# EAGLE design Tomo5 (EAGLE 7.6.0)
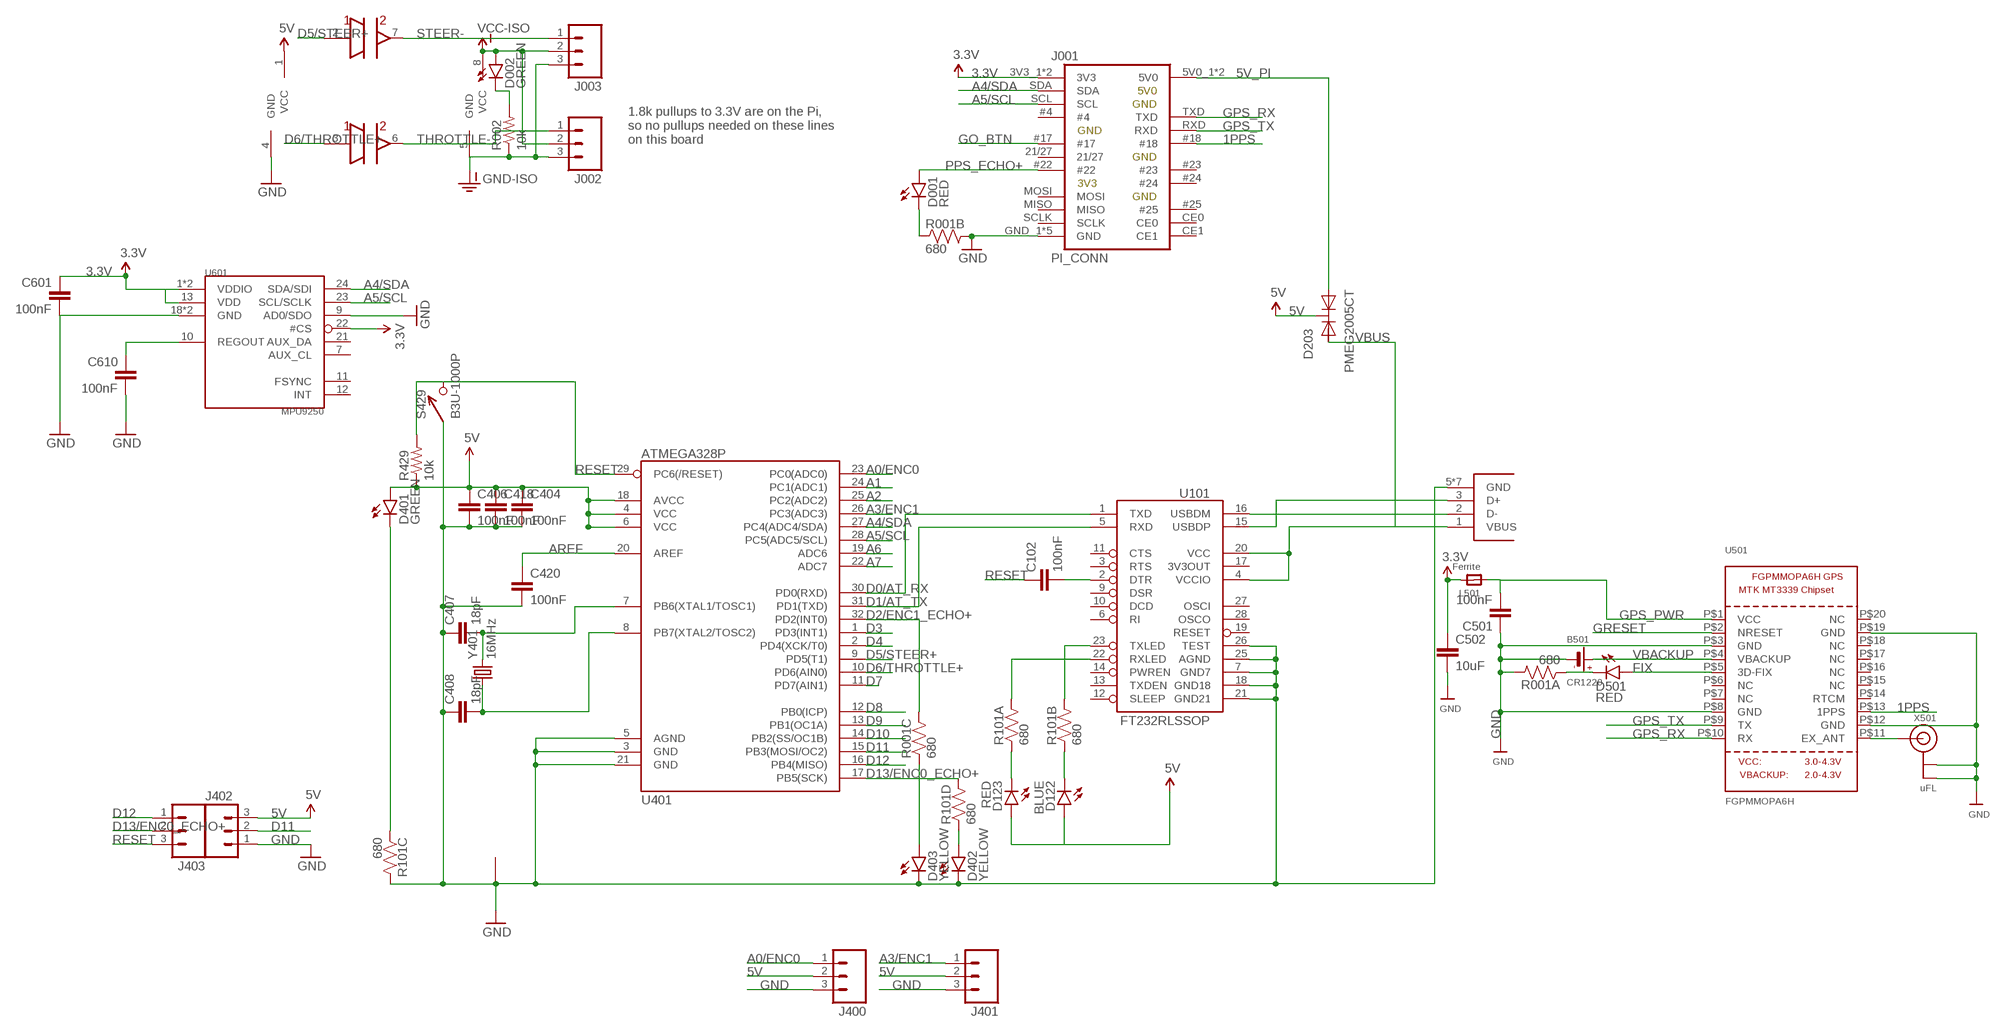
[diagram p0: schematic, sheet 1]

## Parts
B501  CR1220  BATTERYCR1220_2  [CR1220-2]
C102  100nF  CAP0402-CAP  [0402-CAP]
C404  100nF  CAP0402-CAP  [0402-CAP]
C406  100nF  CAP0402-CAP  [0402-CAP]
C407  18pF  CAP0402-CAP  [0402-CAP]
C408  18pF  CAP0402-CAP  [0402-CAP]
C418  100nF  CAP0402-CAP  [0402-CAP]
C420  100nF  CAP0402-CAP  [0402-CAP]
C501  100nF  CAP0402-CAP  [0402-CAP]
C502  10uF  CAP1206  [1206]
C601  100nF  0.1UF-25V(+80/-20%)(0603)  [0603-CAP]
C610  100nF  CAP0402-CAP  [0402-CAP]
D001  RED  LED0603  [LED-0603]
D002  GREEN  LED0603  [LED-0603]
D122  BLUE  LED0603  [LED-0603]
D123  RED  LED0603  [LED-0603]
D203  PMEG2005CT  DIODE_COMMON_CATHODEPMEG2005CT  [SOT-23-3]
D401  GREEN  LED0603  [LED-0603]
D402  YELLOW  LED0603  [LED-0603]
D403  YELLOW  LED0603  [LED-0603]
D501  RED  LED0603  [LED-0603]
J001  PI_CONN  [PI_CONN]
J002  M03PTH  [1X03]
J003  M03PTH  [1X03]
J101  USB_MICROB_JST  [UB-MC5BR3-SD204-4S]
J400  M03PTH  [1X03]
J401  M03PTH  [1X03]
J402  M03PTH  [1X03]
J403  M03PTH  [1X03]
L501  Ferrite  FERRITE-0805NO  [0805-NO]
R001  680  RP404  [CRA04]
R002  10k  RESISTOR0402-RES  [0402-RES]
R101  680  RP404  [CRA04]
R429  10k  RESISTOR0402-RES  [0402-RES]
S429  B3U-1000P  [B3U-1000P]
U101  FT232RLSSOP  [SSOP28DB]
U401  ATMEGA328P  ATMEGA168  [TQFP32-08]
U501  FGPMMOPA6H  GPS_FGPMMOPA6H  [FGPMMOPA6H]
U601  MPU9250  [LQFN_3MM_3MM]
U$7  ADUM3221  [SO8N]
X501  uFL  ANTENNA_U.FL  [U.FL]
Y401  16MHz  CX2520  [CRYSTAL_SMD_2MM_2_5MM]

## Nets
1PPS: J001.#18 U501.P$13(1PPS)
3.3V: C502.1 C601.1 J001.3V3_1(3V3) J001.3V3_2(3V3) L501.2 U601.1(VDDIO) U601.8(VDDIO) U601.13(VDD) U601.22(#CS)
5V: C404.1 C406.1 C418.1 D122.A D123.A D203.3(K) D401.A J400.2 J401.2 J402.3 R429.1 U401.4(VCC) U401.6(VCC) U401.18(AVCC) U$7.1(INP:VCC)
5V_PI: D203.1(A1) J001.5V0_1(5V0) J001.5V0_2(5V0)
A0/ENC0: J400.1 U401.23(PC0(ADC0))
A1: U401.24(PC1(ADC1))
A2: U401.25(PC2(ADC2))
A3/ENC1: J401.1 U401.26(PC3(ADC3))
A4/SDA: J001.SDA U401.27(PC4(ADC4/SDA)) U601.24(SDA/SDI)
A5/SCL: J001.SCL U401.28(PC5(ADC5/SCL)) U601.23(SCL/SCLK)
A6: U401.19(ADC6)
A7: U401.22(ADC7)
AREF: C420.1 U401.20(AREF)
D0/AT_RX: U101.1(TXD) U401.30(PD0(RXD))
D1/AT_TX: U101.5(RXD) U401.31(PD1(TXD))
D2/ENC1_ECHO+: R001.6 U401.32(PD2(INT0))
D3: U401.1(PD3(INT1))
D4: U401.2(PD4(XCK/T0))
D5/STEER+: U401.9(PD5(T1)) U$7.2(A:IN)
D6/THROTTLE+: U401.10(PD6(AIN0)) U$7.3(B:IN)
D7: U401.11(PD7(AIN1))
D8: U401.12(PB0(ICP))
D9: U401.13(PB1(OC1A))
D10: U401.14(PB2(SS/OC1B))
D11: J402.2 U401.15(PB3(MOSI/OC2))
D12: J403.1 U401.16(PB4(MISO))
D13/ENC0_ECHO+: J403.2 R101.5 U401.17(PB5(SCK))
DTR#: C102.2 U101.2(DTR)
ENC0_ECHO-: D402.A R101.4
FIX: D501.A U501.P$5(3D-FIX)
GND: B501.- C404.2 C406.2 C407.1 C408.1 C418.2 C420.2 C501.1 C502.2 C601.2 C610.2 D402.C D403.C J001.GND_1(GND) J001.GND_2(GND) J001.GND_3(GND) J001.GND_4(GND) J001.GND_5(GND) J101.5(GND) J101.P$6(GND) J101.P$7(GND) J101.P$8(GND) J101.P$9(GND) J101.P$10(GND) J101.P$11(GND) J400.3 J401.3 J402.1 R001.7 R001.8 R101.6 S429.P$1 U101.7(GND7) U101.18(GND18) U101.21(GND21) U101.25(AGND) U101.26(TEST) U401.3(GND) U401.5(AGND) U401.21(GND) U501.P$3(GND) U501.P$8(GND) U501.P$12(GND) U501.P$19(GND) U601.9(AD0/SDO) U601.18(GND) U601.20(GND) U$7.4(INP:GND) X501.1(GND) X501.2(GND) Y401.2 Y401.4
GND-ISO: J002.3 J003.3 R002.1 U$7.5(OUTP:GND)
GO_BTN: J001.#17
GPS_PWR: C501.2 L501.1 U501.P$1(VCC)
GPS_RX: J001.TXD U501.P$10(RX)
GPS_TX: J001.RXD U501.P$9(TX)
GRESET: U501.P$2(NRESET)
IPWR-: D002.C R002.2
N$1: C407.2 U401.7(PB6(XTAL1/TOSC1)) Y401.3
N$2: C408.2 U401.8(PB7(XTAL2/TOSC2)) Y401.1
N$3: J101.3(D+) U101.15(USBDP)
N$4: J101.2(D-) U101.16(USBDM)
N$5: D401.C R101.3
N$6: D501.C R001.1
N$7: U501.P$11(EX_ANT) X501.3(SIGNAL)
N$8: D403.A R001.3
PPS_ECHO+: D001.A J001.#22
PPS_ECHO-: D001.C R001.2
REGOUT: C610.1 U601.10(REGOUT)
RESET: C102.1 J403.3 R429.2 S429.P$2 U401.29(PC6(/RESET))
RXLED+: D123.C R101.1
RXLED-: R101.8 U101.22(RXLED)
STEER-: J003.1 U$7.7(A:OUT)
THROTTLE-: J002.1 U$7.6(B:OUT)
TXLED+: D122.C R101.2
TXLED-: R101.7 U101.23(TXLED)
VBACKUP: B501.+ U501.P$4(VBACKUP)
VBUS: D203.2(A2) J101.1(VBUS) U101.4(VCCIO) U101.20(VCC)
VCC-ISO: D002.A J002.2 J003.2 U$7.8(OUTP:VCC)
Unconnected: J001.21/27 J001.#4 J001.#23 J001.#24 J001.#25 J001.CE0 J001.CE1 J001.MISO J001.MOSI J001.SCLK R001.4 R001.5 U101.3(RTS) U101.6(RI) U101.9(DSR) U101.10(DCD) U101.11(CTS) U101.12(SLEEP) U101.13(TXDEN) U101.14(PWREN) U101.17(3V3OUT) U101.19(RESET) U101.27(OSCI) U101.28(OSCO) U501.P$6(NC) U501.P$7(NC) U501.P$14(RTCM) U501.P$15(NC) U501.P$16(NC) U501.P$17(NC) U501.P$18(NC) U501.P$20(NC) U601.7(AUX_CL) U601.11(FSYNC) U601.12(INT) U601.21(AUX_DA)

## Notes on the sheet
- 1.8k pullups to 3.3V are on the Pi, 
  so no pullups needed on these lines
  on this board

## Library data of the parts
B501 = microbuilder:BATTERY: CR1220 SMT - Digikey: 3001K-ND CD2032 BAT-HLD-001 - Digikey: BAT-HLD-001-ND
C102 C404 C406 C418 C420 C501 = SparkFun:CAP: Capacitor Standard 0603 ceramic capacitor, and 0.1" leaded capacitor.; DIGIKEY: 445-1268-1-ND
C407 C408 = SparkFun:CAP: Capacitor Standard 0603 ceramic capacitor, and 0.1" leaded capacitor.; DIGIKEY: 445-1238-1-ND
C502 C610 = SparkFun-Capacitors:CAP: Capacitor Standard 0603 ceramic capacitor, and 0.1" leaded capacitor.
C601 = SparkFun-Capacitors:0.1UF-25V(+80/-20%)(0603): CAP-00810 Ceramic Standard decoupling cap; PROD_ID: CAP-00810; VALUE: 0.1uF
D001 D501 = SparkFun-LED:LED: LEDs Standard schematic elements and footprints for 5mm, 3mm, 1206, and 0603 sized LEDs. 5mm - Spark Fun Electronics SKU : COM-00529 (and others)
D002 D401 = SparkFun-LED:LED: LEDs Standard schematic elements and footprints for 5mm, 3mm, 1206, and 0603 sized LEDs. 5mm - Spark Fun Electronics SKU : COM-00529 (and others); DIGIKEY: 350-2036-1-ND
D122 = SparkFun-LED:LED: LEDs Standard schematic elements and footprints for 5mm, 3mm, 1206, and 0603 sized LEDs. 5mm - Spark Fun Electronics SKU : COM-00529 (and others); DIGIKEY: 350-2037-1-ND
D123 = SparkFun-LED:LED: LEDs Standard schematic elements and footprints for 5mm, 3mm, 1206, and 0603 sized LEDs. 5mm - Spark Fun Electronics SKU : COM-00529 (and others); DIGIKEY: 754-1359-1-ND
D203 = KwanSystems:DIODE_COMMON_CATHODE
D402 D403 = SparkFun-LED:LED: LEDs Standard schematic elements and footprints for 5mm, 3mm, 1206, and 0603 sized LEDs. 5mm - Spark Fun Electronics SKU : COM-00529 (and others); DIGIKEY: 754-1124-1-ND
J001 = KwanSystems:PI_CONN: Raspberry Pi A/B 26-pin connector. Not valid for Pi 2/3, which have 40 pin connectors.
J002 J003 J400-J403 = SparkFun-Connectors:M03: Header 3 Standard 3-pin 0.1" header. Use with straight break away headers (SKU : PRT-00116), right angle break away headers (PRT-00553), swiss pins (PRT-00743), machine pins (PRT-00117), and female headers (PRT-00115). Molex polarized connector foot print use with SKU : PRT-08232 with associated crimp pins and housings.; DIGIKEY: $NOPART
J101 = KwanSystems:USB_MICROB_JST; DIGIKEY: 455-2562-1-ND
L501 = microbuilder:FERRITE: Ferrite Bead 0603 MMZ1608B121C - 120 Ohm @ 100MHz, 600mA, 0.15 Ohm DC Resistance - Digikey: 445-2164-1-ND BK1608HW121-T - 120 Ohm, 600mA Ferrite Chip - Digikey: 587-1876-2-ND 0805 HZ0805B272R-10 - 2.7K Ohm @ 100MHz, 200mA, 0.8 Ohm DC Resistance - Digikey: 240-2504-1-ND (see also Murata BLM21BD272SN1L) MMZ2012Y152B - 1.5K Ohm @ 100MHz, 500mA, 0.4 Ohm DC Resistance - Digikey: 445-1560-1-ND - Mainly for high frequency (80-400MHz) MMZ2012R102A - 1K Ohm @ 100MHz, 500mA, 0.3 Ohm DC Resistance - Digikey: 445-1555-2-ND - More general purpose (10-200MHz)
R001 R101 = KwanSystems:RP4; DIGIKEY: CRA4S8680CT-ND
R002 R429 = SparkFun-Passives:RESISTOR: Resistor Basic schematic elements and footprints for 0603, 1206, and PTH resistors.; DIGIKEY: P10.0KLCT-ND
S429 = KwanSystems:B3U-1000P
U101 = SparkFun-DigitalIC:FT232RL: USB UART FT232RL 4th Generation USB UART (USB <-> Serial) Controller. Spark Fun Electronics SKU : COM-00650; DIGIKEY: 768-1007-1-ND
U401 = SparkFun-DigitalIC:ATMEGA168: Atmel 32-pin 8-bit micro, 16k flash.; DIGIKEY: ATMEGA328P-15AZCT-ND
U501 = microbuilder:GPS_FGPMMOPA6H: GPS Module - MTK MT3339 Chipset, -165dBm sensitivity, 22 channels, 10Hz, auto-select external antenna options
U601 = KwanSystems:MPU9250
U$7 = KwanSystems:ADUM3221: Isolated gate driver
X501 = microbuilder:ANTENNA_U.FL: U.FL Antenna Connector
Y401 = KwanSystems:CX2520; DIGIKEY: 478-6955-1-ND

## Net classes
0 default: width 0.152 mm, drill 0.33 mm, clearance 0.152 mm

## Board
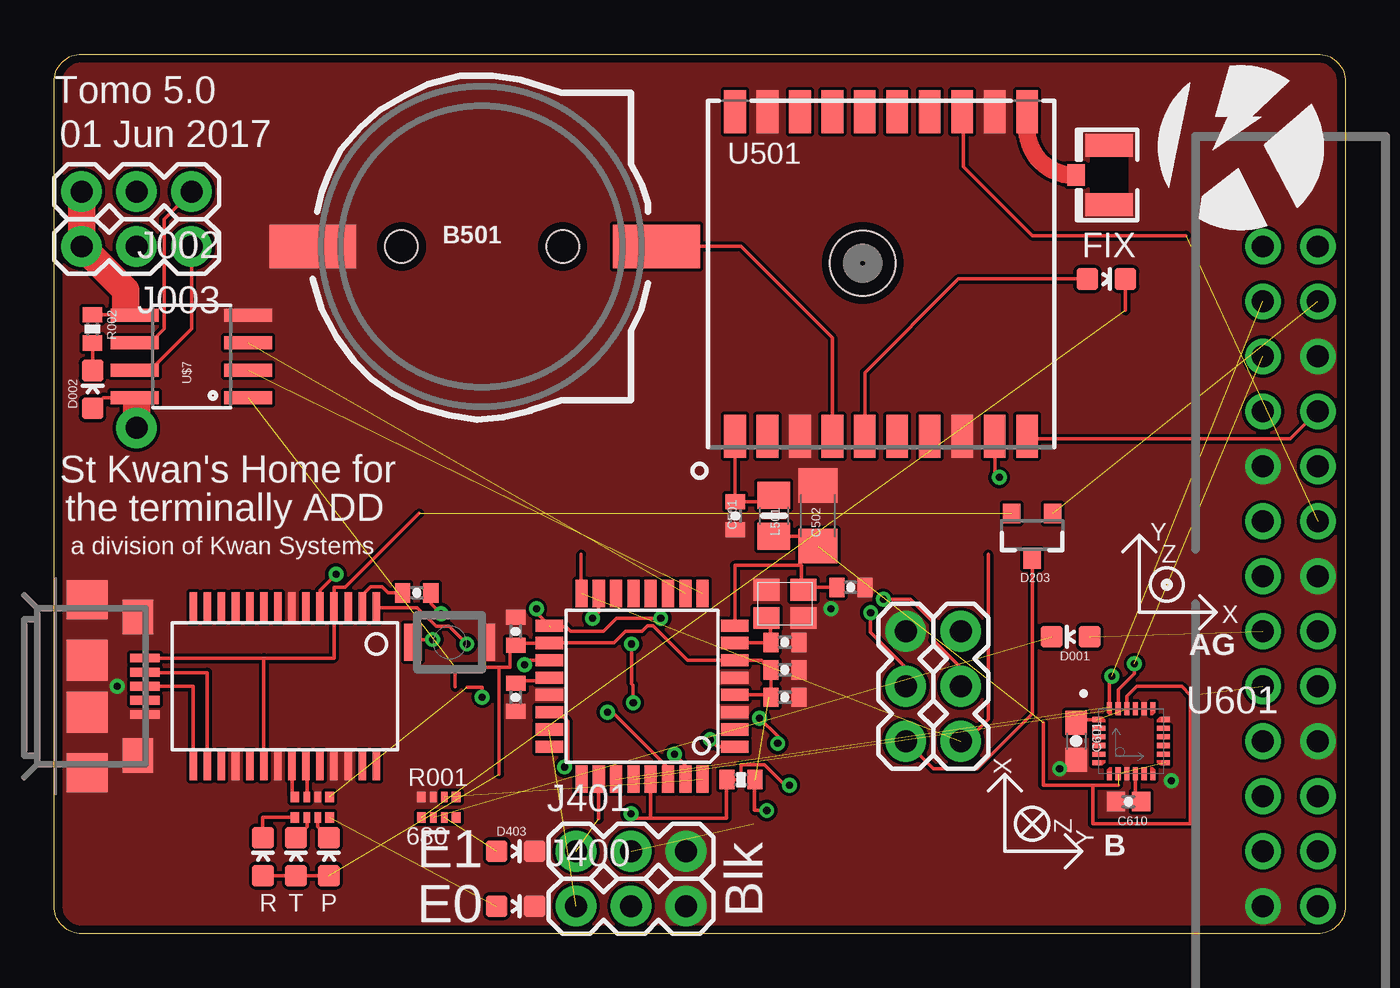
[diagram p1: board, top side]
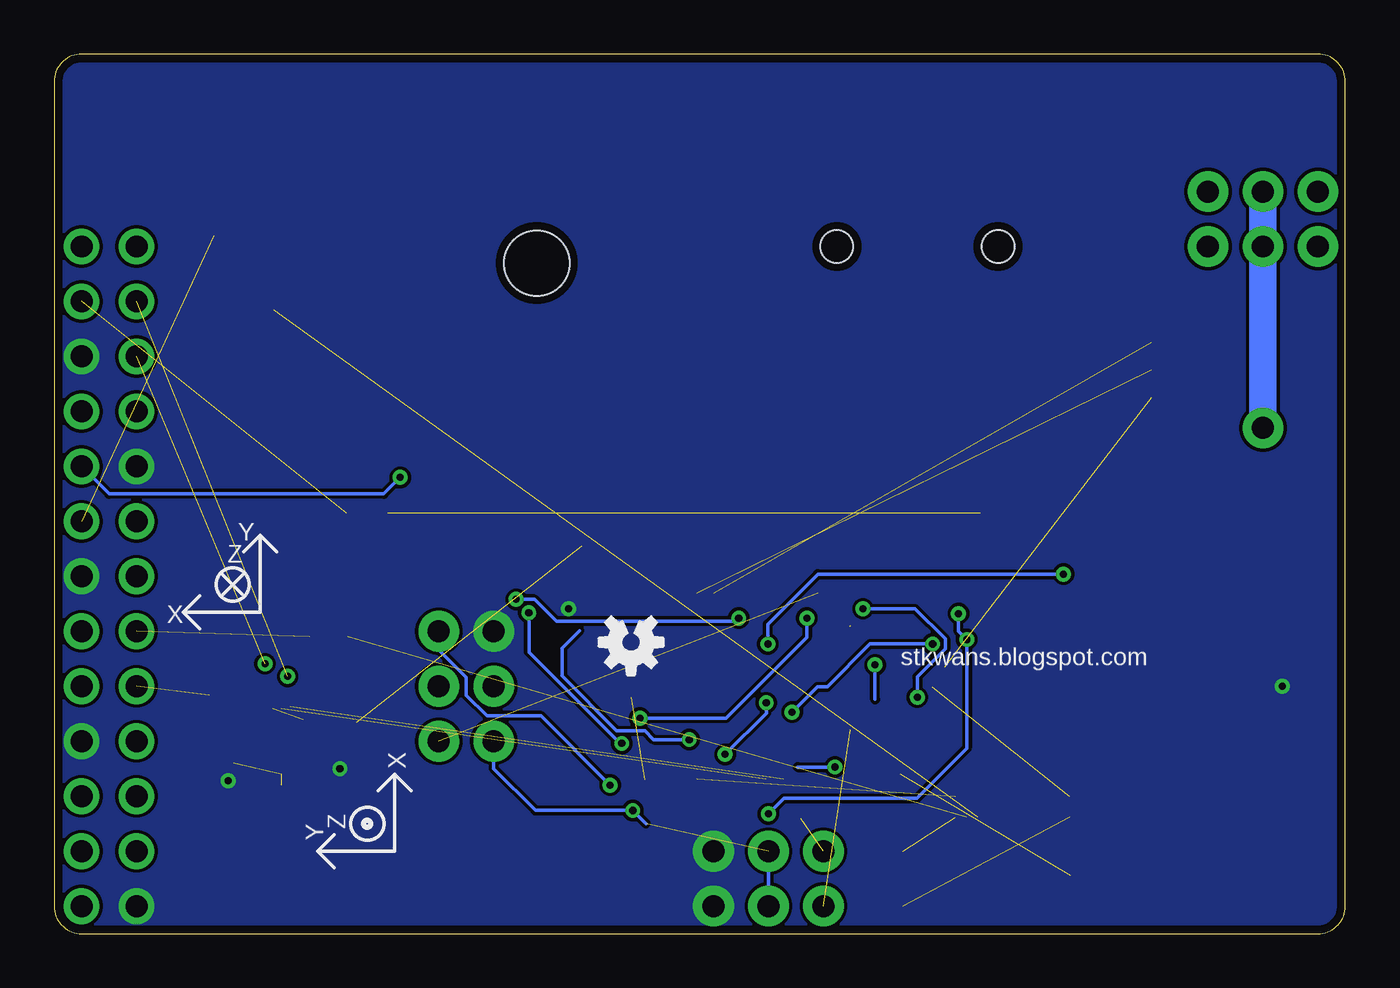
[diagram p2: board, bottom side, seen from below]

Size 59.69 x 40.64 mm. Coordinates in mm from the lower left corner, seen from the top.
Outline: 1.27,40.64 58.42,40.64 arc-90 59.69,39.37 59.69,1.27 arc-90 58.42,0 1.27,0 arc-90 0,1.27 0,39.37 arc-90 1.27,40.64
Copper layers (1*16): Top 0.0356mm / dielectric 1.5011mm / Bottom 0.0356mm
Design rules "default": minimum track width 6mil, minimum drill 13mil, track to track 6mil, track to pad 6mil, pad to pad 6mil, via to via 6mil, smd to smd 6mil, copper to edge 15mil, drill to drill 6mil, minimum pad ring 7mil, minimum via ring 7mil, stop-mask expansion 4mil, vias tented up to drill 14mil, thermal gap 10mil

### Footprints (pad centres in the part's own frame; a part is rotated, then mirrored left to right if it is on the bottom)
CR1220-2 = smd 4 x 2: + 8.29,0; - -7.6,0 | hole 1.5: 3.95,0; -3.5,0
0402-CAP = smd 0.7 x 0.9: 1 -0.65,0; 2 0.65,0
1206 = smd 1.6 x 1.8: 1 -1.4,0; 2 1.4,0
0603-CAP = smd 1.1 x 1: 1 -0.85,0; 2 0.85,0
0402-CAP' = smd 0.85 x 0.9: 1 -0.58,0; 2 0.58,0
LED-0603 = smd 1 x 1: A 0,-0.877; C 0,0.877
SOT-23-3 = smd 0.9 x 0.8: 1 -1,0.95; 2 -1,-0.95; 3 1.1,0
PI_CONN = drill 1.016 pad 1.651: 3V3_1 15.24,1.27; 3V3_2 -5.08,1.27; 5V0_1 12.7,-1.27; 5V0_2 15.24,-1.27; 21/27 0,1.27; #4 7.62,1.27; #17 2.54,1.27; #18 2.54,-1.27; #22 -2.54,1.27; #23 -2.54,-1.27; #24 -5.08,-1.27; #25 -10.16,-1.27; CE0 -12.7,-1.27; CE1 -15.24,-1.27; GND_1 5.08,1.27; GND_2 -15.24,1.27; GND_3 -7.62,-1.27; GND_4 0,-1.27; GND_5 10.16,-1.27; MISO -10.16,1.27; MOSI -7.62,1.27; RXD 5.08,-1.27; SCL 10.16,1.27; SCLK -12.7,1.27; SDA 12.7,1.27; TXD 7.62,-1.27
1X03 = drill 1.016 pad 1.88: 1 0,0; 2 2.54,0; 3 5.08,0
UB-MC5BR3-SD204-4S = smd 0.4 x 1.35: 1 -1.3,2.675; 2 -0.65,2.675; 3 0,2.675; 4 0.65,2.675; 5 1.3,2.675 | smd 1.8 x 1.9: P$6 4,0; P$7 -4,0 | smd 1.9 x 1.9: P$8 -1.2,0; P$9 1.2,0 | smd 1.6 x 1.4: P$10 -3.2,2.35; P$11 3.2,2.35
0805-NO = smd 1.24 x 1.5: 1 -0.95,0; 2 0.95,0
CRA04 = smd 0.4 x 0.5: 1 -0.8,-0.475; 4 0.8,-0.475; 5 0.8,0.475; 8 -0.8,0.475 | smd 0.3 x 0.5: 2 -0.25,-0.475; 3 0.25,-0.475; 6 0.25,0.475; 7 -0.25,0.475
0402-RES = smd 0.7 x 0.9: 1 -0.65,0; 2 0.65,0
B3U-1000P = smd 0.8 x 1.7: P$1 -1.7,0; P$2 1.7,0
SSOP28DB = smd 0.348 x 1.397: 1 -4.225,-3.656; 2 -3.575,-3.656; 3 -2.925,-3.656; 4 -2.275,-3.656; 5 -1.625,-3.656; 6 -0.975,-3.656; 7 -0.325,-3.656; 8 0.325,-3.656; 9 0.975,-3.656; 10 1.625,-3.656; 11 2.275,-3.656; 12 2.925,-3.656; 13 3.575,-3.656; 14 4.225,-3.656; 15 4.225,3.656; 16 3.575,3.656; 17 2.925,3.656; 18 2.275,3.656; 19 1.625,3.656; 20 0.975,3.656; 21 0.325,3.656; 22 -0.325,3.656; 23 -0.975,3.656; 24 -1.625,3.656; 25 -2.275,3.656; 26 -2.925,3.656; 27 -3.575,3.656; 28 -4.225,3.656
TQFP32-08 = smd 1.27 x 0.559: 1 -4.293,2.8; 2 -4.293,2; 3 -4.293,1.2; 4 -4.293,0.4; 5 -4.293,-0.4; 6 -4.293,-1.2; 7 -4.293,-2; 8 -4.293,-2.8; 17 4.293,-2.8; 18 4.293,-2; 19 4.293,-1.2; 20 4.293,-0.4; 21 4.293,0.4; 22 4.293,1.2; 23 4.293,2; 24 4.293,2.8 | smd 0.559 x 1.27: 9 -2.8,-4.293; 10 -2,-4.293; 11 -1.2,-4.293; 12 -0.4,-4.293; 13 0.4,-4.293; 14 1.2,-4.293; 15 2,-4.293; 16 2.8,-4.293; 25 2.8,4.293; 26 2,4.293; 27 1.2,4.293; 28 0.4,4.293; 29 -0.4,4.293; 30 -1.2,4.293; 31 -2,4.293; 32 -2.8,4.293
FGPMMOPA6H = smd 2 x 1: P$1 -7.5,6.75; P$2 -7.5,5.25; P$3 -7.5,3.75; P$4 -7.5,2.25; P$5 -7.5,0.75; P$6 -7.5,-0.75; P$7 -7.5,-2.25; P$8 -7.5,-3.75; P$9 -7.5,-5.25; P$10 -7.5,-6.75; P$11 7.5,-6.75; P$12 7.5,-5.25; P$13 7.5,-3.75; P$14 7.5,-2.25; P$15 7.5,-0.75; P$16 7.5,0.75; P$17 7.5,2.25; P$18 7.5,3.75; P$19 7.5,5.25; P$20 7.5,6.75 | hole 3: 0.5,0.85
LQFN_3MM_3MM = smd 0.4 x 0.24: 1 -1.6,1; 6 -1.6,-1; 13 1.6,-1; 18 1.6,1 | smd 0.6 x 0.24: 2 -1.5,0.6; 3 -1.5,0.2; 4 -1.5,-0.2; 5 -1.5,-0.6; 14 1.5,-0.6; 15 1.5,-0.2; 16 1.5,0.2; 17 1.5,0.6 | smd 0.24 x 0.4: 7 -1,-1.6; 12 1,-1.6; 19 1,1.6; 24 -1,1.6 | smd 0.24 x 0.6: 8 -0.6,-1.5; 9 -0.2,-1.5; 10 0.2,-1.5; 11 0.6,-1.5; 20 0.6,1.5; 21 0.2,1.5; 22 -0.2,1.5; 23 -0.6,1.5
SO8N = smd 0.61 x 2.21: 1 -1.905,-2.616; 2 -0.635,-2.616; 3 0.635,-2.616; 4 1.905,-2.616; 5 1.905,2.616; 6 0.635,2.616; 7 -0.635,2.616; 8 -1.905,2.616
U.FL = smd 2.2 x 1.05: 1 0,1.375; 2 0,-1.375 | smd 0.8 x 1: 3 1.525,0
CRYSTAL_SMD_2MM_2_5MM = smd 1.2 x 1: 1 -0.85,-0.65; 2 0.85,-0.65; 3 0.85,0.65; 4 -0.85,0.65

### Placement (x,y rotation side)
B501  19.56,31.75 0 top
C102  16.76,15.75 180 top
C404  33.78,10.92 0 top
C406  33.78,12.19 0 top
C407  33.78,13.46 180 top
C408  36.83,16 180 top
C418  21.34,13.97 90 top
C420  21.34,10.92 270 top
C501  31.5,19.3 90 top
C502  35.31,19.3 90 top
C601  47.24,8.89 270 top
C610  100nF  [0402-CAP']  49.66,6.1 180 top
D001  46.99,13.72 90 top
D002  1.78,25.15 0 top
D122  11.18,3.56 0 top
D123  9.65,3.56 0 top
D203  45.21,18.41 270 top
D401  12.7,3.56 0 top
D402  21.34,1.27 270 top
D403  21.34,3.81 270 top
D501  48.64,30.25 270 top
J001  57.15,16.51 90 top
J002  6.35,34.29 180 top
J003  6.35,31.75 180 top
J101  1.52,11.43 270 top
J400  24.13,1.27 0 top
J401  24.13,3.81 0 top
J402  39.37,13.97 270 top
J403  41.91,8.89 90 top
L501  33.27,19.3 270 top
R001  17.78,5.84 0 top
R002  1.78,27.94 270 top
R101  11.94,5.84 0 top
R429  31.75,7.11 180 top
S429  18.29,13.46 180 top
U101  10.67,11.43 180 top
U401  27.18,11.43 180 top
U501  38.23,30.48 90 top
U601  49.78,8.89 0 top
U$1  [KWAN_CIRCLE]  54.86,36.32 0 top
U$2  [OSHW-LOGO-S]  33.02,13.46 180 bottom
U$3  [AXES]  50.16,14.86 0 top
U$4  [AXES]  43.94,3.81 90 bottom
U$7  6.35,26.67 90 top
X501  48.77,35.05 180 top
Y401  33.78,15.24 180 top

### Tracks (layer width: path | path; a pad name or v marks a point on that pad's centre or on a via)
1PPS  (1 unrouted)
  Top 0.152: 52.32,32.26 45.21,32.26 42.04,35.43 42.04,37.92
  Top 0.406: 42.04,37.92 U501.P$13
3.3V  (5 unrouted)
  Top 0.152: U601.1 47.39,9.89 arc90 C601.1 | U601.22 49.58,10.98 50.04,11.43 52.12,11.43 52.53,11.02 52.53,5.08 48.01,5.08 48.01,6.86 | 49.18,6.86 48.01,6.86 | 48.01,6.86 45.72,6.86 45.72,9.74 | L501.2 34.86,18.35 arc-90 C502.1
5V  (via drill 0.33)  (5 unrouted)
  Top 0.152: C404.1 33.2,10.9 33.25,10.9 33.27,10.92 | 31.47,11.05 U401.4 33.17,11.03 33.27,10.92 | 33.27,10.92 C404.1 | C404.1 33.02,10.92 | 32.38,7.11 32.38,5.69 v32.94,5.69 | 20.57,12.32 21.08,12.32 21.08,13.21 21.19,13.32 C418.1 21.39,13.36 21.44,13.41 22.89,13.41 U401.18 25.88,13.43 26.42,13.97 27.18,13.97 27.43,14.22 27.69,14.22 29.28,12.63 U401.6 32.69,12.62 33.07,12.24 C406.1 C404.1 | 20.57,12.32 18.54,12.32 18.54,12.31 18.54,11.4 | 20.57,7.37 20.57,12.32 | D203.3 45.21,10.16 42.67,7.62 40.64,7.62 J402.3 | D123.A D122.A D401.A
  Bottom 0.152: J402.3 39.37,7.62 37.44,5.69 v32.94,5.69 32.33,5.08 | J401.2 J400.2
5V_PI  (1 unrouted)
A0/ENC0  (1 unrouted)
A3/ENC1  (1 unrouted)
  Top 0.152: U401.26 25.18,5.3
A4/SDA  (via drill 0.33)  (2 unrouted)
  Top 0.152: U601.24 48.78,11.78 v48.9,11.89
A5/SCL  (via drill 0.33)  (2 unrouted)
  Top 0.152: v49.94,12.47 49.94,12.01 49.39,11.46 49.18,11.26 U601.23 | U401.28
A6  (via drill 0.33)
  Top 0.152: v21.74,12.42 21.95,12.62 U401.19
  Bottom 0.152: 21.74,10.82 v21.74,12.42
A7  (via drill 0.33)
  Top 0.152: v23.6,7.7 23.75,7.85 23.75,9.8 23.34,10.21 22.89,10.21 U401.22
  Bottom 0.152: 25.32,7.7 v23.6,7.7
AREF
  Top 0.152: 21.34,11.58 C420.1 | 21.29,11.53 C420.1 | U401.20 22.89,11.68 21.34,11.68 C420.1
D0/AT_RX  (via drill 0.33)
  Top 0.152: v19.07,13.39 18.26,14.2 17.65,14.2 16.79,15.06 14.91,15.06 U101.1 | v25.58,10.24 25.81,10.24 28.35,7.7 28.35,7.19 U401.30
  Bottom 0.152: v19.07,13.39 21.97,13.39 23.95,11.4 24.41,11.4 v25.58,10.24
D1/AT_TX  (via drill 0.33)
  Top 0.152: v28.68,8.28 29.16,7.8 29.16,7.14 U401.31 | v13.03,16.61 12.29,15.88 U101.5 | v26.7,13.39 26.7,11.56 26.77,11.48 v26.77,10.67
  Bottom 0.152: v13.03,16.61 24.38,16.61 26.7,14.3 v26.7,13.39 | v26.77,10.67 26.77,10.19 v28.68,8.28
D2/ENC1_ECHO+  (1 unrouted)
  Top 0.152: U401.32
D3  (via drill 0.33)
  Top 0.152: v30.33,8.97 30.66,8.64 U401.1
  Bottom 0.152: v30.33,8.97 31.98,8.97 32.38,9.37 33.68,9.37 36.22,11.91 36.22,13.18 35.41,13.99
D5/STEER+  (1 unrouted)
D6/THROTTLE+  (1 unrouted)
D11  (via drill 0.33)
  Top 0.152: v24.89,14.58 25.17,14.86 U401.15 | J402.2 39.37,12.29 37.74,13.92 v37.74,14.83 | v33.45,8.79 33.45,9.12 v32.61,9.96
  Bottom 0.152: v37.74,14.83 37.74,13.01 33.53,8.79 v33.45,8.79 | v32.61,9.96 28.63,9.96 24.89,13.69 v24.89,14.58
D12  (1 unrouted)
  Top 0.152: U401.16 24.36,15.72 24.36,17.53 | 43.18,17.53 43.18,9.91 42.16,8.89 J403.1
D13/ENC0_ECHO+  (via drill 0.33)  (2 unrouted)
  Top 0.152: J403.2 41.91,12.29 40.64,13.56 40.64,14.38 39.57,15.44 v38.33,15.44 | v28.04,14.58 26.01,14.58 25.4,13.97 23.88,13.97 23.67,14.17 22.94,14.17 | v22.3,15.01 22.3,14.83 22.89,14.25 U401.17 | 19.1,11.38 19.79,11.38 v19.79,10.92
  Bottom 0.152: v38.33,15.44 37.49,15.44 36.47,14.43 28.19,14.43 v28.04,14.58 | v19.79,10.92 19.79,11.86 18.49,13.16 18.49,13.61 19.89,15.01 v22.3,15.01
DTR#
  Top 0.152: C102.2 15.44,15.75 15.16,16.03 14.63,16.03 14.25,15.65 U101.2
ENC0_ECHO-  (1 unrouted)
FIX
  Top 0.152: U501.P$5 37.48,25.92 41.81,30.25 D501.A
GND  (via drill 0.33)
  other vias: 2.92,11.43 35.92,15.01 51.64,7.06 46.48,7.62
  pour Top (no thermals): 1.27,40.64 58.42,40.64 arc-90 59.69,39.37 59.69,1.27 arc-90 58.42,0 1.27,0 arc-90 0,1.27 0,39.37 arc-90
  pour Bottom (no thermals): 1.27,40.64 58.42,40.64 arc-90 59.69,39.37 59.69,1.27 arc-90 58.42,0 1.27,0 arc-90 0,1.27 0,39.37 arc-90
GND-ISO
  Top 0.152: R002.1 3.72,28.59 U$7.5 3.35,28.96 3.3,28.96
  Top 1.27: J002.3 J003.3 3.3,29.72 3.3,28.96
GPS_PWR
  Top 0.152: U501.P$1 31.48,19.97 C501.2 32.97,19.95 L501.1
GPS_RX
  Top 0.152: U501.P$10 45.09,22.98 45.21,22.86 57.15,22.86 J001.TXD
GPS_TX  (via drill 0.33)
  Top 0.152: U501.P$9 43.48,21.29 v43.69,21.08
  Bottom 0.152: v43.69,21.08 44.45,20.32 57.15,20.32 J001.RXD
IPWR-
  Top 0.152: R002.2 D002.C
N$1
  Top 0.152: Y401.3 32.94,14.58 33.12,14.4 C407.2 33.07,13.44 U401.7
N$2
  Top 0.152: C408.2 34.75,16 34.65,15.9 Y401.1 34.54,15.98 34.54,17.02 31.47,17.02 U401.8 31.47,14.66
N$3
  Top 0.152: U101.15 6.43,7.8 6.43,11.43 J101.3
N$4
  Top 0.152: J101.2 4.22,12.06 7.09,12.06 7.09,7.8 U101.16
N$5
  Top 0.152: R101.3 12.19,4.95 D401.C
N$6  (1 unrouted)
  Top 0.152: D501.C 49.52,28.8
N$7
  Top 0.813: U501.P$11 44.98,37.06 arc90 X501.3
N$8  (1 unrouted)
PPS_ECHO+  (1 unrouted)
PPS_ECHO-  (1 unrouted)
REGOUT
  Top 0.152: U601.10 49.98,6.1 C610.1
RESET  (via drill 0.33)
  Top 0.152: v17.88,14.78 17.42,15.24 17.42,15.75 C102.1 | v17.5,13.59 16.74,13.59 16.61,13.46 | U401.29 27.58,5.33 | v33.98,6.86 33.88,6.76 32.84,7.8 31.75,7.8 31.75,7.11 31.17,7.11 31.17,7.14 31.1,7.14 R429.2 31.09,5.33 27.58,5.33 | 27.58,5.33 26.87,5.33 v26.67,5.54
  Top 0.406: 16.61,13.46 S429.P$2
  Bottom 0.152: v17.88,14.78 17.88,13.97 v17.5,13.59 17.5,8.56 19.81,6.25 25.96,6.25 v26.67,5.54 | J403.3 41.91,13.11 40.64,11.84 40.64,11.02 39.67,10.06 37.19,10.06 v33.98,6.86
RXLED+
  Top 0.152: R101.1 9.65,5.37 D123.C
RXLED-
  Top 0.152: R101.8 10.99,6.46 U101.22
STEER-
  Top 0.152: J003.1 6.35,28.45 6.35,27.94 4.45,26.04 U$7.7
THROTTLE-
  Top 0.152: J002.1 5.08,33.02 5.08,27.94 4.32,27.18 U$7.6
TXLED+
  Top 0.152: R101.2 11.69,4.95 D122.C
TXLED-
  Top 0.152: R101.7 11.69,7.73 U101.23
VBACKUP
  Top 0.152: B501.+ 31.75,31.75 35.98,27.52 U501.P$4
VBUS  (1 unrouted)
  Top 0.152: J101.1 9.69,12.73 | 9.69,12.73 U101.20 | 9.69,12.73 12.94,12.73 U101.4 12.94,16 13.46,16 16.88,19.41
VCC-ISO  (via drill 1.02 pad 1.88)
  Top 0.152: D002.A 2.27,24.77 U$7.8 3.81,24.38
  Top 1.27: v3.81,23.37 3.81,24.38
  Bottom 1.27: J002.2 J003.2 v3.81,23.37

### Text on the board
tPlace: Tomo 5.0 | 01 Jun 2017 | FIX | St Kwan's Home for | the terminally ADD | a division of Kwan Systems | AG | B | E1 | R | T | P | E0 | Blk
bPlace: stkwans.blogspot.com
Measures: All units in inch